# EAGLE design sistem minimum (EAGLE 9.6.2)
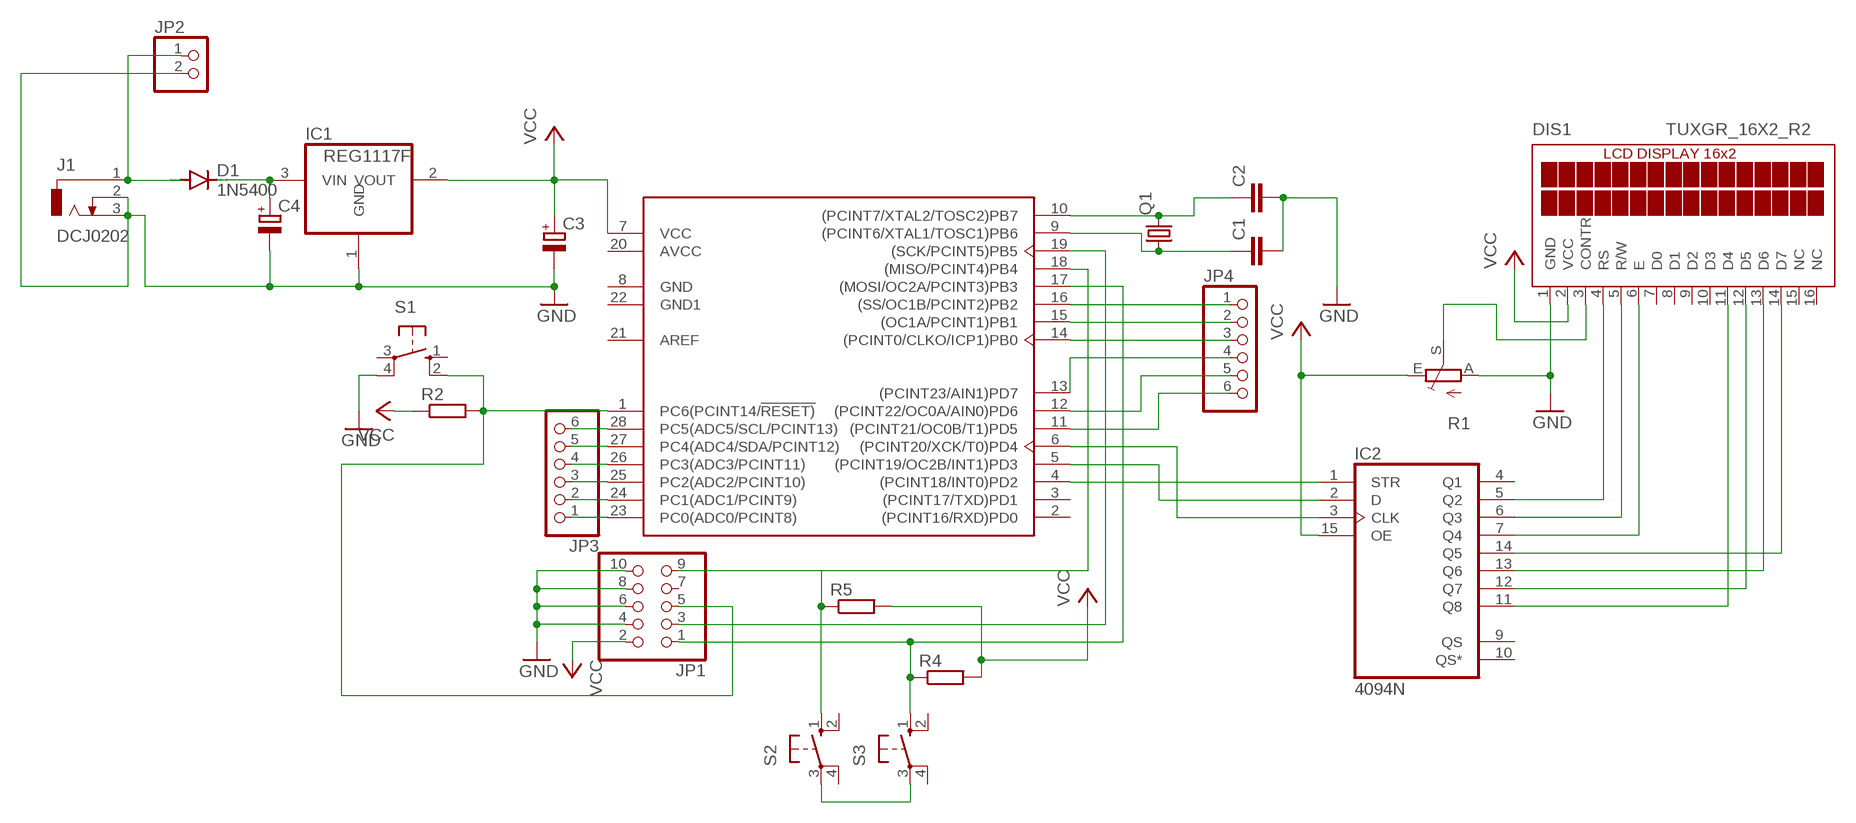
[diagram p0: schematic, sheet 1]

## Parts
C1  C2,5-3  [C2.5-3]
C2  C2,5-3  [C2.5-3]
C3  CPOL-EUE2.5-6  [E2,5-6]
C4  CPOL-EUE2.5-6  [E2,5-6]
D1  1N5400  [DO201-15]
DIS1  TUXGR_16X2_R2  [TUXGR_16X2_R2]
IC1  REG1117F  [DD-3]
IC2  4094N  [DIL16]
J1  DCJ0202  [DCJ0202]
JP1  PINHD-2X5  [2X05]
JP2  PINHD-1X2  [1X02]
JP3  PINHD-1X6  [1X06]
JP4  PINHD-1X6  [1X06]
Q1  CRYSTALHC49S  [HC49/S]
R1  TRIM_EU-B25P  [B25P]
R2  R-EU_0204/7  [0204/7]
R4  R-EU_0204/7  [0204/7]
R5  R-EU_0204/7  [0204/7]
S1  10-XX  [B3F-10XX]
S2  10-XX  [B3F-10XX]
S3  10-XX  [B3F-10XX]
U1  ATMEGA328P-PU  [DIP-28]

## Nets
GND: C1.2 C2.2 C3.- C4.- DIS1.1(GND) IC1.1(GND) J1.2 J1.3 JP1.4 JP1.6 JP1.8 JP1.10 JP2.2 R1.A S1.4(P1)
N$1: C2.1 Q1.2 U1.10((PCINT7/XTAL2/TOSC2)PB7)
N$2: C1.1 Q1.1 U1.9((PCINT6/XTAL1/TOSC1)PB6)
N$3: JP1.9 U1.18((MISO/PCINT4)PB4)
N$4: JP1.5 R2.2 S1.2(S1) U1.1(PC6(PCINT14/!RESET))
N$5: JP1.3 U1.19((SCK/PCINT5)PB5)
N$6: JP1.1 R4.1 S3.1(S) U1.17((MOSI/OC2A/PCINT3)PB3)
N$7: S2.3(P) S3.3(P)
N$8: C4.+ D1.C IC1.3(VIN)
N$9: D1.A J1.1 JP2.1
N$10: R5.1 S2.1(S)
N$11: IC2.1(STR) U1.4((PCINT18/INT0)PD2)
N$12: IC2.2(D) U1.5((PCINT19/OC2B/INT1)PD3)
N$13: IC2.3(CLK) U1.6((PCINT20/XCK/T0)PD4)
N$14: DIS1.4(RS) IC2.5(Q2)
N$15: DIS1.5(R/W) IC2.6(Q3)
N$16: DIS1.6(E) IC2.7(Q4)
N$17: DIS1.11(D4) IC2.11(Q8)
N$18: DIS1.12(D5) IC2.12(Q7)
N$19: DIS1.13(D6) IC2.13(Q6)
N$20: DIS1.14(D7) IC2.14(Q5)
N$21: JP3.6 U1.28(PC5(ADC5/SCL/PCINT13))
N$22: DIS1.3(CONTR) R1.S
N$23: JP3.5 U1.27(PC4(ADC4/SDA/PCINT12))
N$24: JP3.4 U1.26(PC3(ADC3/PCINT11))
N$25: JP3.3 U1.25(PC2(ADC2/PCINT10))
N$26: JP3.2 U1.24(PC1(ADC1/PCINT9))
N$27: JP3.1 U1.23(PC0(ADC0/PCINT8))
N$28: JP4.1 U1.16((SS/OC1B/PCINT2)PB2)
N$29: JP4.2 U1.15((OC1A/PCINT1)PB1)
N$30: JP4.3 U1.14((PCINT0/CLKO/ICP1)PB0)
N$31: JP4.4 U1.13((PCINT23/AIN1)PD7)
N$32: JP4.5 U1.12((PCINT22/OC0A/AIN0)PD6)
N$33: JP4.6 U1.11((PCINT21/OC0B/T1)PD5)
VCC: C3.+ DIS1.2(VCC) IC1.2(VOUT) IC2.15(OE) JP1.2 R1.E R2.1 R4.2 R5.2 U1.7(VCC)
Unconnected: DIS1.7(D0) DIS1.8(D1) DIS1.9(D2) DIS1.10(D3) DIS1.15(NC) DIS1.16(NC) IC2.4(Q1) IC2.9(QS) IC2.10(QS*) JP1.7 S1.1(S) S1.3(P) S2.2(S1) S2.4(P1) S3.2(S1) S3.4(P1) U1.2((PCINT16/RXD)PD0) U1.3((PCINT17/TXD)PD1) U1.21(AREF)

## Power pins joined to a net without a drawn wire
AVCC: U1.20(AVCC)
GND: U1.8(GND)
GND1: U1.22(GND1)
VDD: IC2.16(VDD)
VSS: IC2.8(VSS)

## Library data of the parts
C1 C2 = capacitor-wima:C: CAPACITOR naming: grid - package width
C3 C4 = resistor:CPOL-EU: POLARIZED CAPACITOR, European symbol
D1 = diode:1N5400: DIODE standard rectifier, 3 A, 50 V (Motorola)
DIS1 = display-lcd:TUXGR_16X2_R2: Tuxgraphics LCD display 16x2 characters reflective, without background light Source: tuxgr_12x2_r2.pdf; OC_FARNELL: unknown; OC_NEWARK: unknown
IC1 = burr-brown:REG1117: 800mA and 1A Low Dropout (LDO) Positive Regulator 1.8V, 2.5V, 2.85V, 3.3V, 5V, and Adj; MF: TEXAS INSTRUMENTS; MPN: REG1117FAKTTT; OC_FARNELL: 1296120; OC_NEWARK: 87H2562
IC2 = 40xx:4094: 8-stage SHIFT/STORE REGISTER, tri-state
J1 = con-jack:DCJ0202: DC POWER JACK Source: DCJ0202.pdf; OC_FARNELL: unknown; OC_NEWARK: unknown
JP1 = pinhead:PINHD-2X5: PIN HEADER
JP2 = pinhead:PINHD-1X2: PIN HEADER
JP3 JP4 = pinhead:PINHD-1X6: PIN HEADER
Q1 = crystal:CRYSTAL: CRYSTAL; OC_FARNELL: 1667008; OC_NEWARK: unknown
R1 = pot:TRIM_EU-: POTENTIOMETER
R2 R4 R5 = resistor:R-EU_: RESISTOR, European symbol
S1-S3 = switch-omron:10-XX: OMRON SWITCH; MPN: B3F-1000; OC_FARNELL: 176432; OC_NEWARK: 36M3542
U1 = Microcontroller:ATMEGA328P-PU: IC MCU 8BIT 32KB FLASH 28DIP Manufacturer's datasheet <http://ww1.microchip.com/downloads/en/DeviceDoc/ATmega48A-PA-88A-PA-168A-PA-328-P-DS-DS40002061A.pdf>; CREATED_BY: PCBLayout.com; DIGIKEY_PART_NUMBER: ATMEGA328P-PU-ND; MANUFACTURER: Microchip Technology; MPN: ATMEGA328P-PU; PACKAGE: DIP-28

## Board
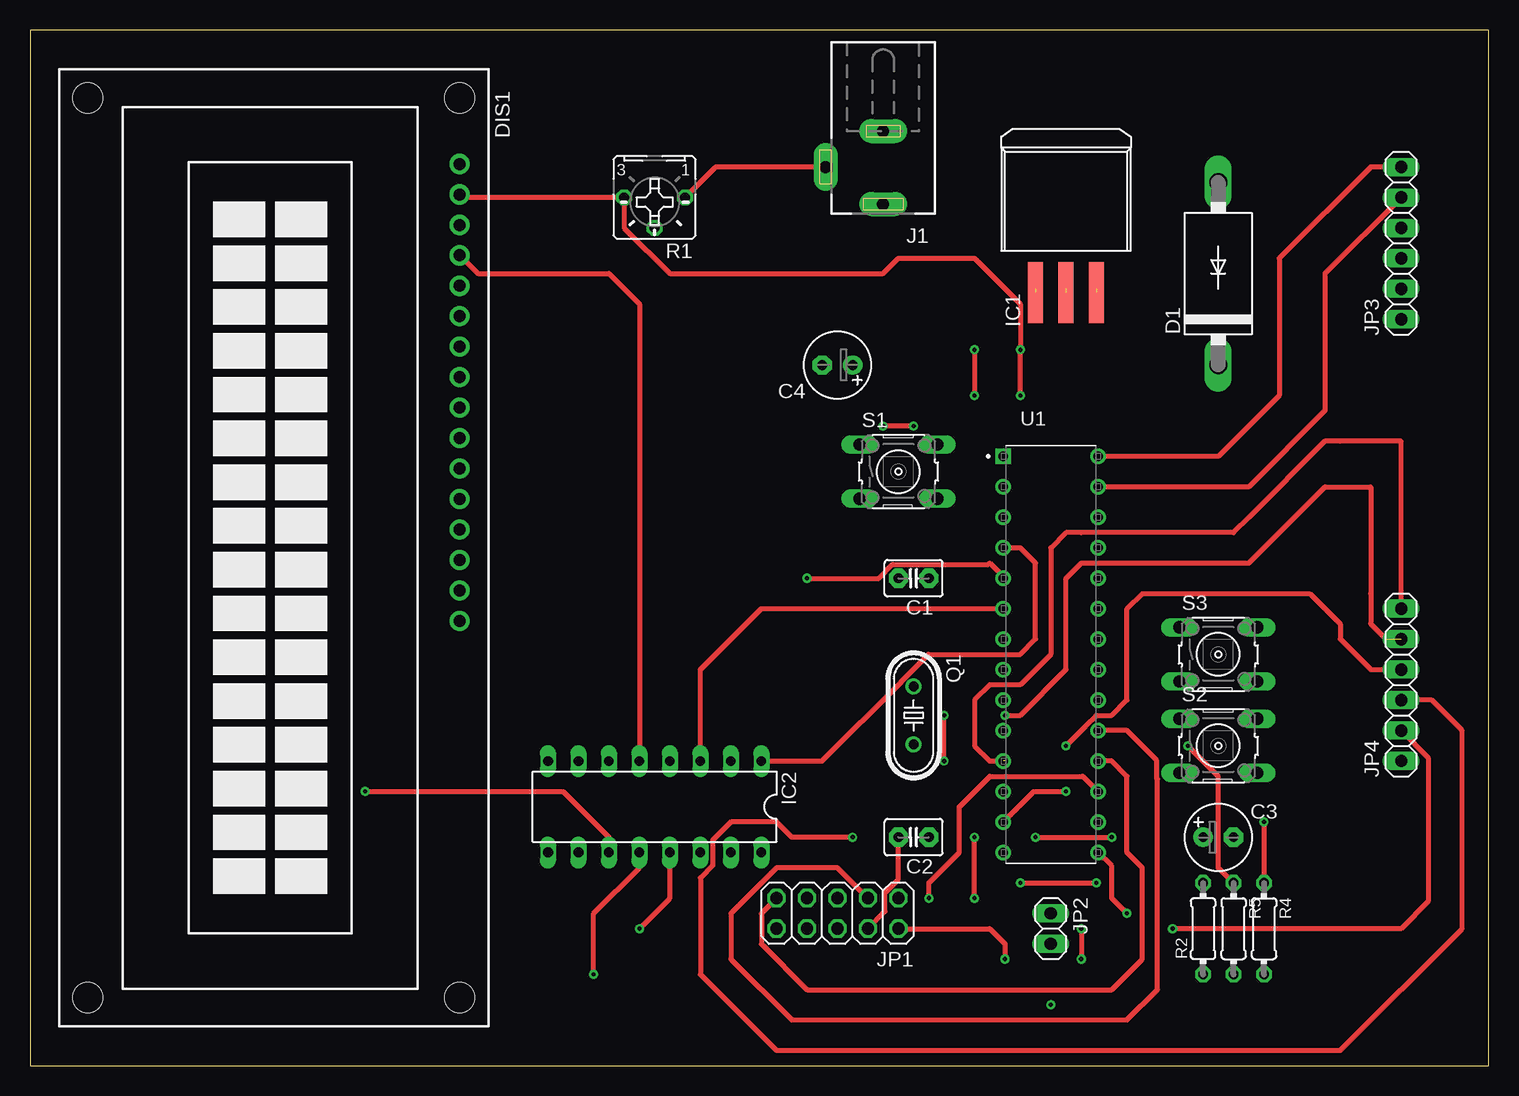
[diagram p1: board, top side]
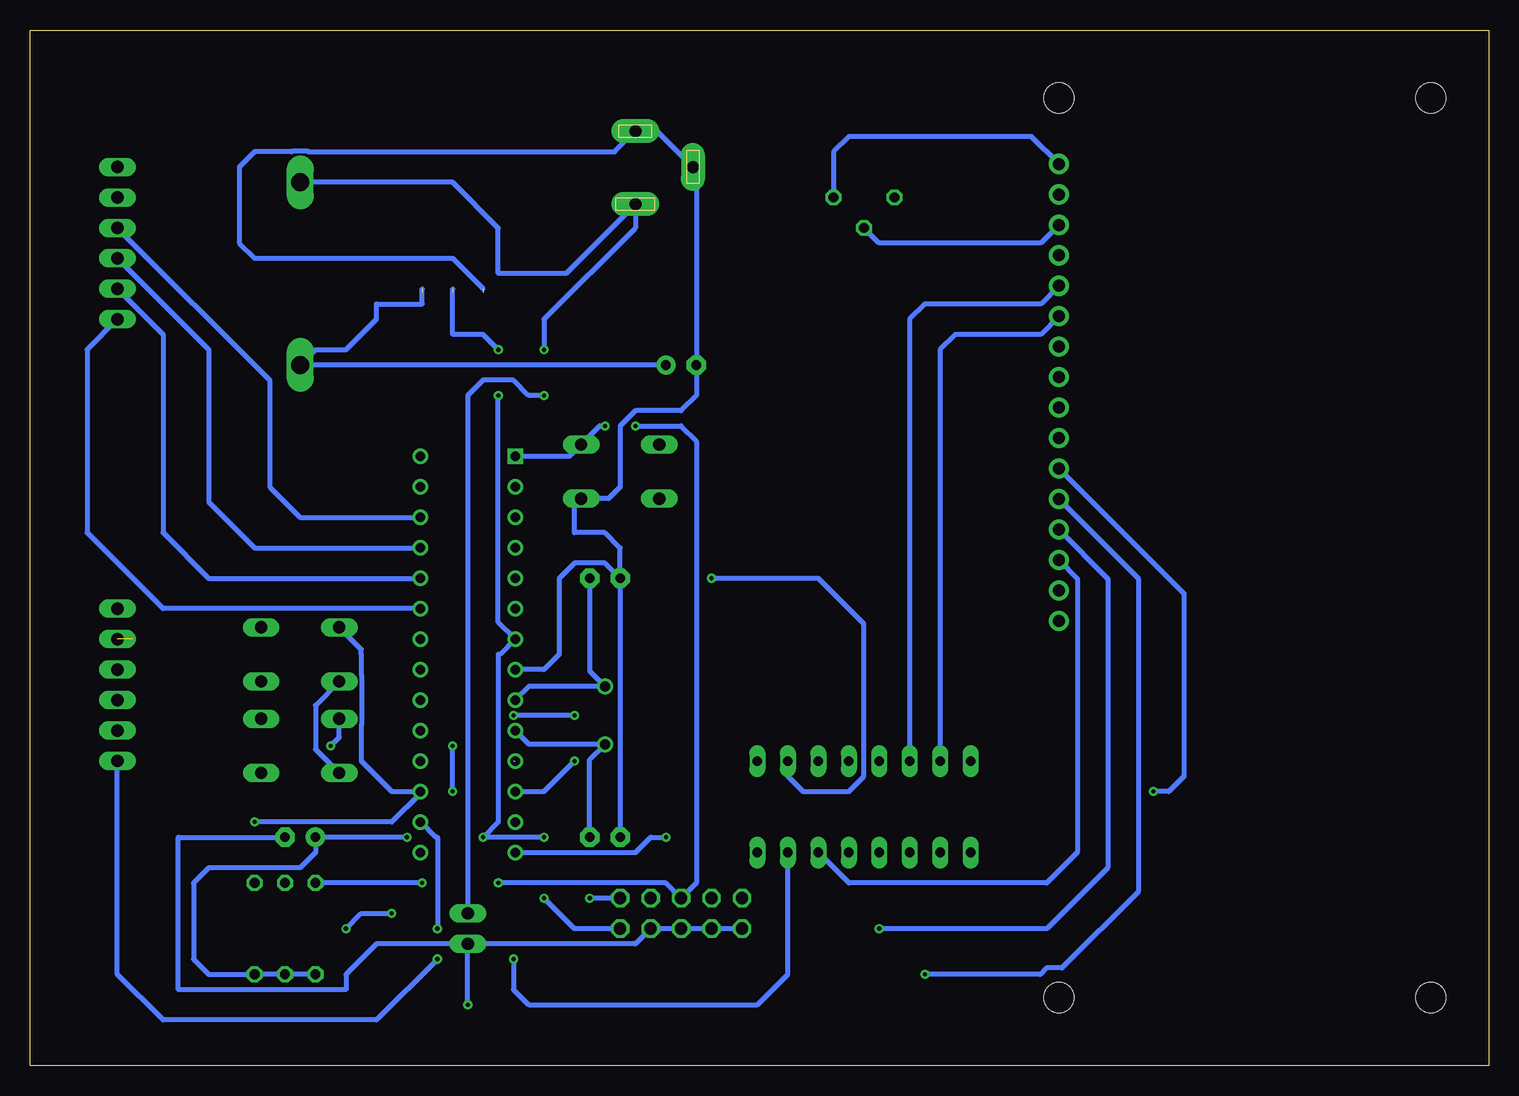
[diagram p2: board, bottom side, seen from below]

Size 121.59 x 86.35 mm. Coordinates in mm from the lower left corner, seen from the top.
Outline: 0,0 121.59,0 121.59,86.35 0,86.35 0,0
Copper layers (1*16): Top 0.035mm / dielectric 1.5mm / Bottom 0.035mm
Design rules "default": minimum track width 6mil, minimum drill 0.35mm, track to track 6mil, track to pad 6mil, pad to pad 6mil, via to via 6mil, smd to smd 6mil, copper to edge 40mil, drill to drill 6mil, minimum pad ring 10mil, minimum via ring 8mil, stop-mask expansion 4mil, vias tented up to drill 0mil, thermal gap 10mil

### Footprints (pad centres in the part's own frame; a part is rotated, then mirrored left to right if it is on the bottom)
C2.5-3 = drill 0.813 pad 1.6 octagon: 1 -1.27,0; 2 1.27,0
E2,5-6 = drill 0.813 pad 1.6: + -1.27,0 | drill 0.813 pad 1.6 octagon: - 1.27,0
DO201-15 = drill 1.499 long: A 7.62,0; C -7.62,0
TUXGR_16X2_R2 = drill 1 pad 1.676: 1 -32,15.5; 2 -29.46,15.5; 3 -26.92,15.5; 4 -24.38,15.5; 5 -21.84,15.5; 6 -19.3,15.5; 7 -16.76,15.5; 8 -14.22,15.5; 9 -11.68,15.5; 10 -9.14,15.5; 11 -6.6,15.5; 12 -4.06,15.5; 13 -1.52,15.5; 14 1.02,15.5; 15 3.56,15.5; 16 6.1,15.5 | hole 2.5: -37.5,-15.5; 37.5,-15.5; -37.5,15.5; 37.5,15.5
DD-3 = smd 1.27 x 5.08: 1 -2.54,-7.938; 2 0,-7.938; 3 2.54,-7.938
DIL16 = drill 0.813 long: 1 -8.89,-3.81; 2 -6.35,-3.81; 3 -3.81,-3.81; 4 -1.27,-3.81; 5 1.27,-3.81; 6 3.81,-3.81; 7 6.35,-3.81; 8 8.89,-3.81; 9 8.89,3.81; 10 6.35,3.81; 11 3.81,3.81; 12 1.27,3.81; 13 -1.27,3.81; 14 -3.81,3.81; 15 -6.35,3.81; 16 -8.89,3.81
DCJ0202 = drill 1 pad 2 long: 1 0,3.1; 2 4.8,0; 3 0,-3
2X05 = drill 1.016 octagon: 1 -5.08,-1.27; 2 -5.08,1.27; 3 -2.54,-1.27; 4 -2.54,1.27; 5 0,-1.27; 6 0,1.27; 7 2.54,-1.27; 8 2.54,1.27; 9 5.08,-1.27; 10 5.08,1.27
1X02 = drill 1.016 long: 1 -1.27,0; 2 1.27,0
1X06 = drill 1.016 long: 1 -6.35,0; 2 -3.81,0; 3 -1.27,0; 4 1.27,0; 5 3.81,0; 6 6.35,0
HC49/S = drill 0.813: 1 -2.413,0; 2 2.413,0
B25P = drill 0.813 octagon: A -2.54,0; E 2.54,0; S 0,2.54
0204/7 = drill 0.813 octagon: 1 -3.81,0; 2 3.81,0
B3F-10XX = drill 1.016 long: 1 -3.251,2.261; 2 3.251,2.261; 3 -3.251,-2.261; 4 3.251,-2.261
DIP-28 = drill 0.79 pad 1.19 square: 1 -3.95,16.51 | drill 0.79 pad 1.19: 2 -3.95,13.97; 3 -3.95,11.43; 4 -3.95,8.89; 5 -3.95,6.35; 6 -3.95,3.81; 7 -3.95,1.27; 8 -3.95,-1.27; 9 -3.95,-3.81; 10 -3.95,-6.35; 11 -3.95,-8.89; 12 -3.95,-11.43; 13 -3.95,-13.97; 14 -3.95,-16.51; 15 3.95,-16.51; 16 3.95,-13.97; 17 3.95,-11.43; 18 3.95,-8.89; 19 3.95,-6.35; 20 3.95,-3.81; 21 3.95,-1.27; 22 3.95,1.27; 23 3.95,3.81; 24 3.95,6.35; 25 3.95,8.89; 26 3.95,11.43; 27 3.95,13.97; 28 3.95,16.51

### Placement (x,y rotation side)
C1  73.66,40.64 180 top
C2  73.66,19.05 180 top
C3  99.06,19.05 0 top
C4  67.31,58.42 180 top
D1  99.06,66.04 90 top
DIS1  20.32,43.18 270 top
IC1  86.36,72.39 0 top
IC2  52.07,21.59 180 top
J1  71.12,74.93 180 top
JP1  67.31,12.7 180 top
JP2  85.09,11.43 270 top
JP3  114.3,68.58 90 top
JP4  114.3,31.75 90 top
Q1  73.66,29.21 270 top
R1  52.07,72.39 180 top
R2  97.79,11.43 90 top
R4  102.87,11.43 270 top
R5  100.33,11.43 270 top
S1  72.39,49.53 0 top
S2  99.06,26.67 0 top
S3  99.06,34.29 0 top
U1  85.09,34.29 0 top

### Tracks (layer width: path | path; a pad name or v marks a point on that pad's centre or on a via)
GND  (via drill 0.35)  (1 unrouted)
  Top 0.406: JP1.4 71.27,12.85 71.27,14.43 72.39,15.55 C2.2 | J1.2 57.15,74.93 R1.A
  Bottom 0.406: C1.2 C2.2 | C1.2 73.66,41.91 76.2,41.91 77.47,40.64 77.47,34.29 78.74,33.02 U1.8 | C1.2 72.39,43.18 73.66,44.45 76.2,44.45 76.2,46.71 S1.4 73.38,47.27 72.39,48.26 72.39,53.34 71.12,54.61 67.31,54.61 66.04,55.88 C4.- 66.04,74.65 J1.2 69.32,77.93 J1.3 72.85,76.2 98.38,76.2 98.45,76.26 99.67,76.26 99.74,76.2 102.87,76.2 104.14,74.93 104.14,68.58 102.87,67.31 86.36,67.31 83.82,64.77 | JP1.10 JP1.8 JP1.6 JP1.4 71.12,10.16 JP2.2 | JP2.2 92.71,10.16 95.25,7.62 95.25,6.35 109.22,6.35 109.22,19.05 C3.- | DIS1.1 38.1,77.47 53.34,77.47 54.61,76.2 R1.A | v85.09,5.08 JP2.2
N$1
  Bottom 0.406: U1.10 80,26.8 Q1.2 74.93,25.53 C2.1
N$2
  Bottom 0.406: U1.9 80,31.62 Q1.1 74.93,32.89 C1.1
N$3
  Top 0.406: JP1.9 60.96,12.7 60.96,10.16 64.77,6.35 90.17,6.35 92.71,8.89 92.71,16.51 91.44,17.78 91.44,24.13 90.17,25.4 U1.18 89.04,25.26
N$4  (via drill 0.35)
  Top 0.406: v73.66,53.34 v71.12,53.34 | v82.55,15.24 v88.9,15.24
  Bottom 0.406: S1.2 76.63,50.8 U1.1 | 75.21,51.79 S1.2 | S1.2 74.09,53.34 v73.66,53.34 | v71.12,53.34 67.31,53.34 66.04,52.07 66.04,15.24 JP1.5 68.58,15.24 v82.55,15.24 | v88.9,15.24 R2.2
N$5
  Top 0.406: JP1.3 67.31,16.51 62.23,16.51 58.42,12.7 58.42,8.89 63.5,3.81 91.44,3.81 93.98,6.35 93.98,23.9 93.93,23.95 93.93,25.45 91.44,27.94 U1.19
N$6  (via drill 0.35)
  Top 0.406: v74.93,13.97 74.93,15.24 77.47,17.78 77.47,21.59 80.01,24.13 87.77,24.13 U1.17 | v102.87,20.32 R4.1
  Bottom 0.406: JP1.1 v74.93,13.97 | v102.87,20.32 91.44,20.32 89.04,22.72 U1.17 91.44,22.86 93.98,25.4 93.98,28.42 93.93,28.47 93.93,32.49 93.98,32.54 93.98,34.29 93.98,34.72 S3.1
N$7
  Bottom 0.406: 96.52,31.75 96.09,31.75 S3.3 97.79,30.05 97.79,26.39 S2.3
N$8  (1 unrouted)
  Bottom 0.406: C4.+ D1.C 97.79,59.69 95.25,59.69 92.71,62.23 92.71,63.5 88.9,63.5 88.9,64.77
N$9  (via drill 0.35)
  Top 0.406: v78.74,59.69 v78.74,55.88
  Bottom 0.406: D1.A 86.36,73.66 82.55,69.85 82.55,66.04 76.91,66.04 J1.1 71.12,69.85 78.74,62.23 v78.74,59.69 | v78.74,55.88 80.01,55.88 81.28,57.15 83.82,57.15 85.09,55.88 JP2.1
N$10  (via drill 0.35)
  Top 0.406: R5.1 99.06,16.51 99.06,24.13 v96.52,26.67
  Bottom 0.406: v96.52,26.67 95.81,27.38 S2.1
N$11
  Top 0.406: IC2.1 66.04,25.4 72.64,32 72.64,32.04 74.89,34.29 82.55,34.29 83.82,35.56 83.82,41.91 82.55,43.18 U1.4
N$12  (via drill 0.35)
  Top 0.406: v64.77,40.64 70.76,40.64 71.91,41.8 79.9,41.8 80.01,41.91 81.14,40.78 U1.5
  Bottom 0.406: IC2.2 58.42,24.13 57.15,22.86 53.34,22.86 52.07,24.13 52.07,36.83 55.88,40.64 v64.77,40.64
N$13
  Top 0.406: IC2.3 55.88,33.02 60.96,38.1 U1.6
N$14
  Top 0.406: DIS1.4 37.34,66.04 48.26,66.04 50.8,63.5 IC2.5
N$15
  Bottom 0.406: DIS1.5 37.34,63.5 46.99,63.5 48.26,62.23 IC2.6
N$16
  Bottom 0.406: DIS1.6 37.34,60.96 44.45,60.96 45.72,59.69 IC2.7
N$17  (via drill 0.35)
  Top 0.406: v27.94,22.86 44.45,22.86 48.26,19.05 IC2.11
  Bottom 0.406: DIS1.11 25.4,39.36 25.4,24.13 26.67,22.86 v27.94,22.86
N$18  (via drill 0.35)
  Top 0.406: v46.99,7.62 46.99,12.7 50.8,16.51 IC2.12
  Bottom 0.406: DIS1.12 29.21,40.63 29.21,14.5 35.56,8.15 36.84,8.15 37.37,7.62 v46.99,7.62
N$19  (via drill 0.35)
  Top 0.406: v50.8,11.43 53.34,13.97 IC2.13
  Bottom 0.406: DIS1.13 31.76,40.64 31.75,40.64 31.75,16.51 36.83,11.43 v50.8,11.43
N$20
  Bottom 0.406: DIS1.14 34.3,40.64 34.29,40.64 34.29,17.78 36.83,15.24 53.34,15.24 IC2.14
N$21
  Top 0.406: JP3.6 111.76,74.93 104.14,67.31 104.14,55.88 99.06,50.8 U1.28
N$22
  Bottom 0.406: DIS1.3 37.34,68.58 50.8,68.58 R1.S
N$23
  Top 0.406: JP3.5 107.95,66.04 107.95,54.61 101.6,48.26 U1.27
N$24
  Bottom 0.406: U1.26 99.06,45.72 101.6,48.26 101.6,57.15 JP3.4
N$25
  Bottom 0.406: JP3.3 106.68,59.69 106.68,46.99 102.87,43.18 U1.25
N$26
  Bottom 0.406: U1.24 106.68,40.64 110.49,44.45 110.49,60.96 JP3.2
N$27
  Bottom 0.406: JP3.1 116.84,59.69 116.84,44.45 110.49,38.1 U1.23
N$28  (via drill 0.35)
  Top 0.406: v87.63,11.43 v87.63,8.89
  Bottom 0.406: U1.16 87.77,19.05 87.63,19.05 v87.63,11.43 | v87.63,8.89 92.71,3.81 110.49,3.81 114.3,7.62 JP4.1
N$29  (via drill 0.35)
  Top 0.406: JP4.2 116.56,25.68 116.56,13.69 114.3,11.43 v95.25,11.43 | v91.44,12.7 90.17,13.97 90.17,16.65 U1.15
  Bottom 0.406: v95.25,11.43 93.98,12.7 v91.44,12.7
N$30  (via drill 0.35)
  Top 0.406: v68.58,19.05 63.5,19.05 62.23,20.32 58.42,20.32 56.9,18.8 56.9,16.7 55.88,15.68 55.88,7.62 62.23,1.27 109.22,1.27 119.38,11.43 119.38,27.94 116.84,30.48 JP4.3
  Bottom 0.406: U1.14 71.12,17.78 69.85,19.05 v68.58,19.05
N$31  (via drill 0.35)
  Top 0.406: U1.13 83.68,22.86 v86.36,22.86 | v86.36,26.67 88.03,28.34 88.03,28.36 88.89,29.21 90.17,29.21 91.44,30.48 91.44,38.1 92.71,39.37 106.68,39.37 109.22,36.83 109.22,35.56 111.76,33.02 JP4.4
  Bottom 0.406: v86.36,22.86 v86.36,26.67
N$32  (via drill 0.35)  (1 unrouted)
  Top 0.406: v76.2,25.4 v76.2,29.21 | v81.28,29.21 82.55,29.21 86.36,33.02 86.36,40.64 87.63,41.91 90.17,41.91 101.6,41.91 104.14,44.45 107.95,48.26 111.76,48.26 111.76,39.37 111.76,36.83 113.03,35.56
  Bottom 0.406: U1.12 78.74,22.86 v76.2,25.4 | v76.2,29.21 80.01,29.21 v81.28,29.21
N$33  (1 unrouted)
  Top 0.406: JP4.6 114.3,52.07 109.22,52.07 107.95,52.07 101.6,45.72 100.33,44.45 87.63,44.45 86.36,44.45 85.09,43.18 85.09,34.29 82.55,31.75 80.01,31.75 78.74,30.48 78.74,26.67 80.01,25.4 81.28,25.4
VCC  (via drill 0.35)  (1 unrouted)
  Top 0.406: v82.55,55.88 v82.55,59.69 82.55,63.5 78.74,67.31 72.39,67.31 71.12,66.04 53.34,66.04 49.53,69.85 R1.E 36.07,72.39 DIS1.2 | v78.74,13.97 v78.74,19.05 | v83.82,19.05 v90.17,19.05 | JP1.2 80.01,11.43 81.28,10.16 v81.28,8.89
  Bottom 0.406: v82.55,59.69 83.82,60.96 86.36,60.96 86.36,64.77 | v82.55,55.88 82.55,36.97 U1.7 82.41,34.29 82.55,34.29 82.55,20.32 v83.82,19.05 v78.74,19.05 | R2.1 R5.2 R4.2 106.68,7.62 107.95,8.89 107.95,15.24 106.68,16.51 99.06,16.51 97.79,17.78 C3.+ v90.17,19.05 | JP1.2 76.2,11.43 v78.74,13.97 | v81.28,8.89 81.28,6.35 80.01,5.08 60.96,5.08 58.42,7.62 IC2.15